# EAGLE design air-quality-sensor--module-rev-1p-skew-m (EAGLE 8.1.0)
COMPANY: ADAFRUIT INDUSTRIES; DRAWN: KTOWN; REV: B
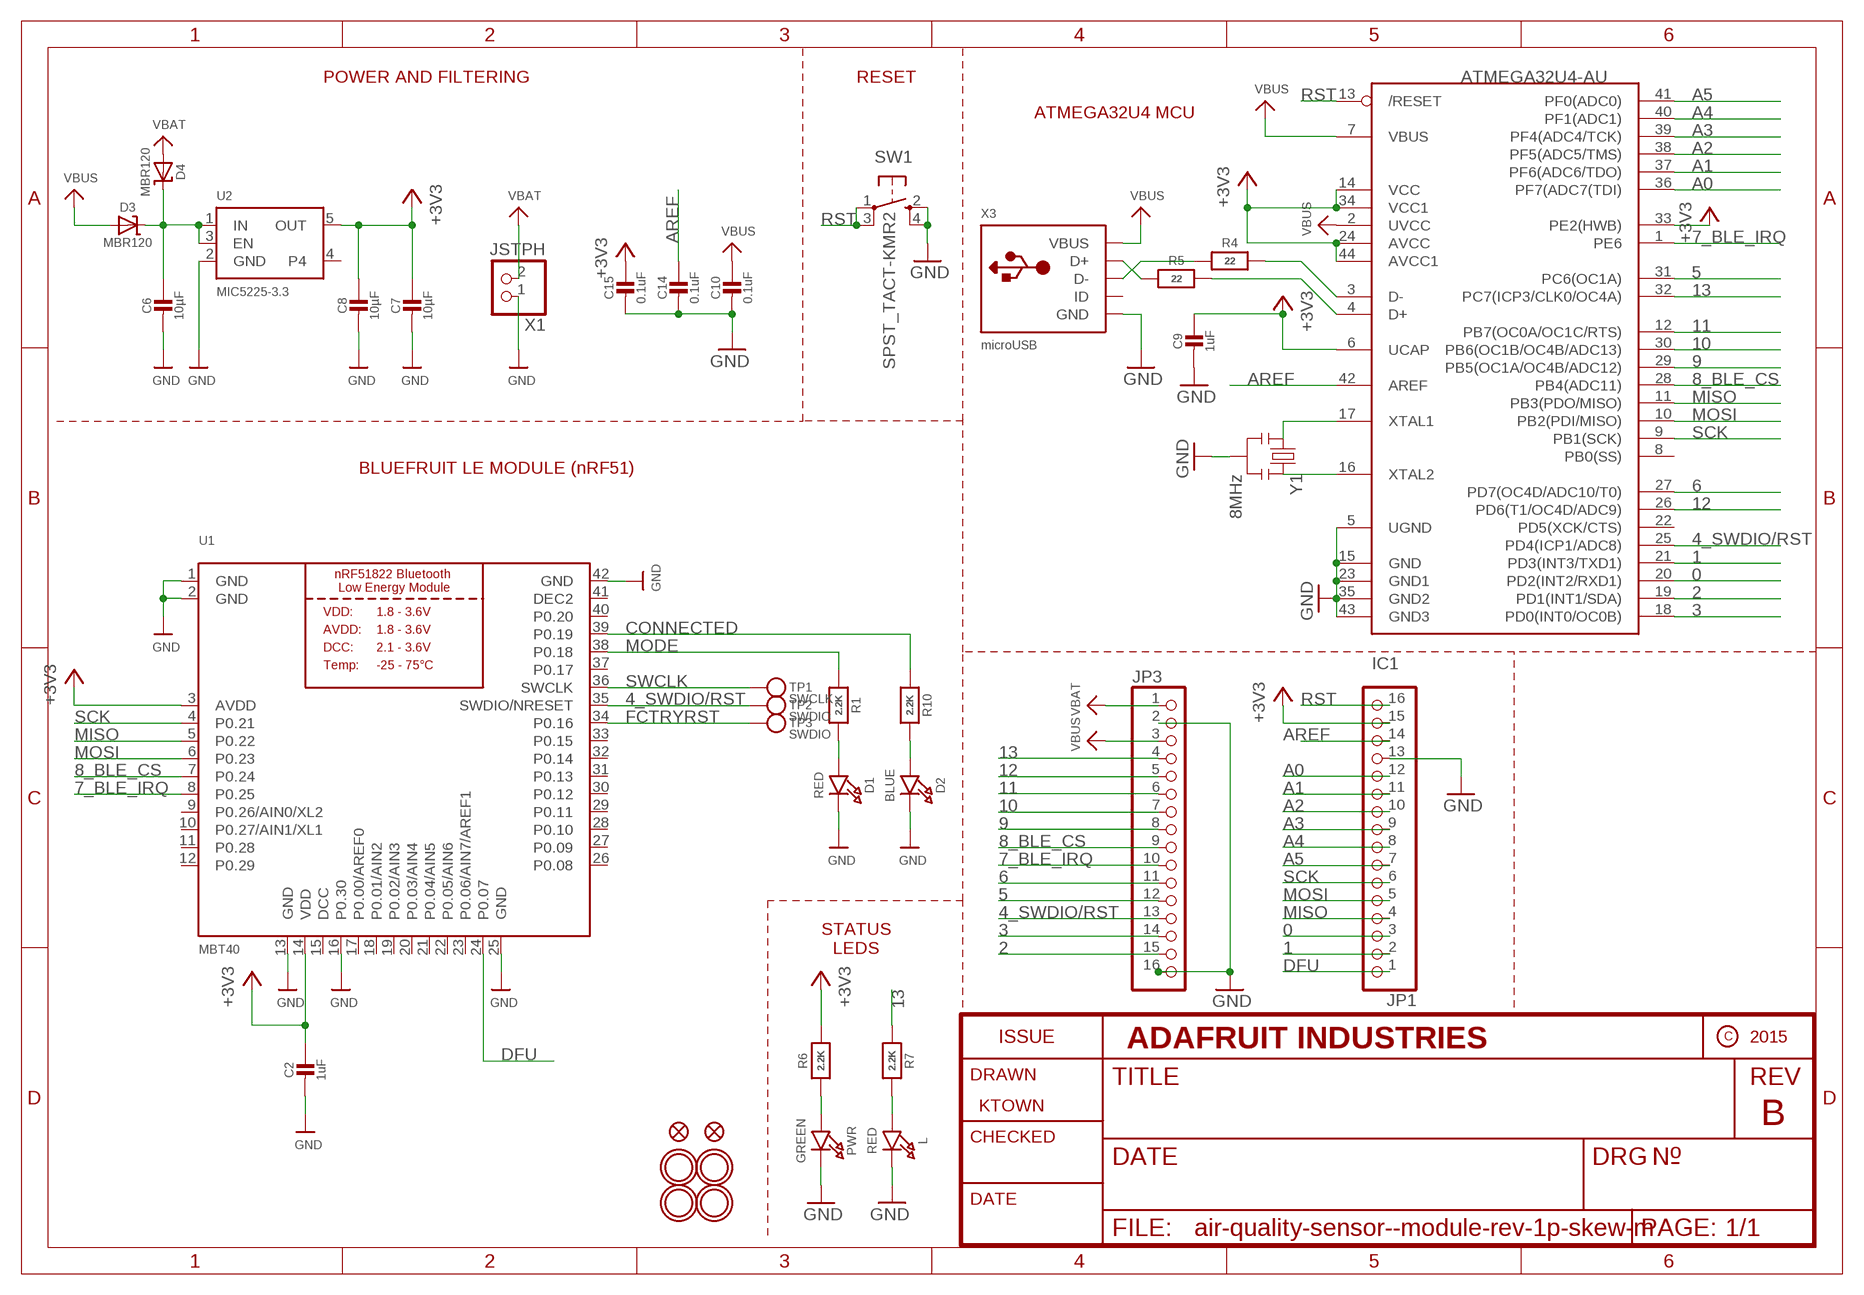
[diagram p0: schematic, sheet 1]

## Parts
C2  1uF  CAP_CERAMIC0805-NOOUTLINE  [0805-NO]
C6  10µF  CAP_CERAMIC_0805MP  [_0805MP]
C7  10µF  CAP_CERAMIC0805-NOOUTLINE  [0805-NO]
C8  10µF  CAP_CERAMIC0805-NOOUTLINE  [0805-NO]
C9  1uF  CAP_CERAMIC0805-NOOUTLINE  [0805-NO]
C10  0.1uF  CAP_CERAMIC0805_10MGAP  [0805_10MGAP]
C14  0.1uF  CAP_CERAMIC0805-NOOUTLINE  [0805-NO]
C15  0.1uF  CAP_CERAMIC0805-NOOUTLINE  [0805-NO]
D1  RED  LED0805_NOOUTLINE  [CHIPLED_0805_NOOUTLINE]
D2  BLUE  LED0805_NOOUTLINE  [CHIPLED_0805_NOOUTLINE]
D3  MBR120  DIODE-SCHOTTKYSOD-123  [SOD-123]
D4  MBR120  DIODE-SCHOTTKYSOD-123  [SOD-123]
IC1  ATMEGA32U4-AU  [TQFP44]
JP1  HEADER-1X16ROUND  [1X16_ROUND]
JP3  HEADER-1X16ROUND  [1X16_ROUND]
L  RED  LED0805_NOOUTLINE  [CHIPLED_0805_NOOUTLINE]
PWR  GREEN  LED0805_NOOUTLINE  [CHIPLED_0805_NOOUTLINE]
R1  2.2K  RESISTOR0805_NOOUTLINE  [0805-NO]
R4  22  RESISTOR0805_NOOUTLINE  [0805-NO]
R5  22  RESISTOR0805_NOOUTLINE  [0805-NO]
R6  2.2K  RESISTOR0805_NOOUTLINE  [0805-NO]
R7  2.2K  RESISTOR0805_NOOUTLINE  [0805-NO]
R10  2.2K  RESISTOR0805_NOOUTLINE  [0805-NO]
SW1  SPST_TACT-KMR2  [KMR2]
TP1  SWCLK  TESTPOINT1.5X2.0MM_NOCREAM  [PAD-1.5X2.0]
TP2  SWDIO  TESTPOINT1.5X2.0MM_NOCREAM  [PAD-1.5X2.0]
TP3  SWDIO  TESTPOINT1.5X2.0MM_NOCREAM  [PAD-1.5X2.0]
U1  MBT40  NRF51822_MODULE_MDBT40  [BLE_MODULE_RAYTAC_MDBT40]
U2  MIC5225-3.3  VREG_SOT23-5  [SOT23-5]
U$6  MOUNTINGHOLE2.5  [MOUNTINGHOLE_2.5_PLATED]
U$24  MOUNTINGHOLE2.5  [MOUNTINGHOLE_2.5_PLATED]
U$31  MOUNTINGHOLE2.5  [MOUNTINGHOLE_2.5_PLATED]
U$32  MOUNTINGHOLE2.5  [MOUNTINGHOLE_2.5_PLATED]
U$34  FIDUCIAL""  [FIDUCIAL_1MM]
U$35  FIDUCIAL""  [FIDUCIAL_1MM]
X1  JSTPH  CON_JST_PH_2PIN  [JSTPH2]
X3  microUSB  USBMICRO_20329  [4UCONN_20329]
Y1  8MHz  RESONATORSMD  [RESONATOR-SMD]

## Nets
0: IC1.20(PD2(INT2/RXD1)) JP1.3
1: IC1.21(PD3(INT3/TXD1)) JP1.2
2: IC1.19(PD1(INT1/SDA)) JP3.15
3: IC1.18(PD0(INT0/OC0B)) JP3.14
4_SWDIO/RST: IC1.25(PD4(ICP1/ADC8)) JP3.13 TP2.P$1 U1.35(SWDIO/NRESET)
5: IC1.31(PC6(OC1A)) JP3.12
6: IC1.27(PD7(OC4D/ADC10/T0)) JP3.11
7_BLE_IRQ: IC1.1(PE6) JP3.10 U1.8(P0.25)
8_BLE_CS: IC1.28(PB4(ADC11)) JP3.9 U1.7(P0.24)
9: IC1.29(PB5(OC1A/OC4B/ADC12)) JP3.8
10: IC1.30(PB6(OC1B/OC4B/ADC13)) JP3.7
11: IC1.12(PB7(OC0A/OC1C/RTS)) JP3.6
12: IC1.26(PD6(T1/OC4D/ADC9)) JP3.5
13: IC1.32(PC7(ICP3/CLK0/OC4A)) JP3.4 R7.1
+3V3: C2.1 C7.1 C8.1 C9.1 C15.1 IC1.6(UCAP) IC1.14(VCC) IC1.24(AVCC) IC1.33(PE2(HWB)) IC1.34(VCC1) IC1.44(AVCC1) JP1.15 R6.2 U1.3(AVDD) U1.14(VDD) U2.5(OUT)
A0: IC1.36(PF7(ADC7(TDI)) JP1.12
A1: IC1.37(PF6(ADC6/TDO)) JP1.11
A2: IC1.38(PF5(ADC5/TMS)) JP1.10
A3: IC1.39(PF4(ADC4/TCK)) JP1.9
A4: IC1.40(PF1(ADC1)) JP1.8
A5: IC1.41(PF0(ADC0)) JP1.7
AREF: C14.1 IC1.42(AREF) JP1.14
CONNECTED: R10.1 U1.39(P0.19)
DFU: JP1.1 U1.24(P0.07)
FCTRYRST: TP3.P$1 U1.34(P0.16)
GND: C2.2 C6.2 C7.2 C8.2 C9.2 C10.2 C14.2 C15.2 D1.C D2.C IC1.5(UGND) IC1.15(GND) IC1.23(GND1) IC1.35(GND2) IC1.43(GND3) JP1.13 JP3.2 JP3.16 L.C PWR.C SW1.2(S) SW1.4(S1) U1.1(GND) U1.2(GND) U1.13(GND) U1.16(P0.30) U1.25(GND) U1.42(GND) U2.2(GND) X1.1 X3.BASE@1(GND) X3.BASE@2(GND) X3.GND X3.SPRT@1(GND) X3.SPRT@2(GND) X3.SPRT@3(GND) X3.SPRT@4(GND) Y1.2
MISO: IC1.11(PB3(PDO/MISO)) JP1.4 U1.5(P0.22)
MODE: R1.1 U1.38(P0.18)
MOSI: IC1.10(PB2(PDI/MISO)) JP1.5 U1.6(P0.23)
N$2: L.A R7.2
N$5: D1.A R1.2
N$6: D2.A R10.2
N$9: IC1.3(D-) R4.2
N$10: IC1.4(D+) R5.2
N$11: IC1.16(XTAL2) Y1.3
N$12: IC1.17(XTAL1) Y1.1
N$13: PWR.A R6.1
N$15: R5.1 X3.D+
N$16: R4.1 X3.D-
N$17: C6.1 D3.C D4.C U2.1(IN) U2.3(EN)
RST: IC1.13(/RESET) JP1.16 SW1.1(P) SW1.3(P1)
SCK: IC1.9(PB1(SCK)) JP1.6 U1.4(P0.21)
SWCLK: TP1.P$1 U1.36(SWCLK)
VBAT: D4.A JP3.1 X1.2
VBUS: C10.1 D3.A IC1.2(UVCC) IC1.7(VBUS) JP3.3 X3.VBUS
Unconnected: IC1.8(PB0(SS)) IC1.22(PD5(XCK/CTS)) U1.9(P0.26/AIN0/XL2) U1.10(P0.27/AIN1/XL1) U1.11(P0.28) U1.12(P0.29) U1.17(P0.00/AREF0) U1.18(P0.01/AIN2) U1.19(P0.02/AIN3) U1.20(P0.03/AIN4) U1.21(P0.04/AIN5) U1.22(P0.05/AIN6) U1.23(P0.06/AIN7/AREF1) U1.26(P0.08) U1.27(P0.09) U1.28(P0.10) U1.29(P0.11) U1.30(P0.12) U1.31(P0.13) U1.32(P0.14) U1.33(P0.15) U1.37(P0.17) U1.40(P0.20) U2.4 X3.ID

## Notes on the sheet
- POWER AND FILTERING | RESET
- ATMEGA32U4 MCU
- BLUEFRUIT LE MODULE (nRF51)
- STATUS
  LEDS

## Power pins joined to a net without a drawn wire
DCC: U1.15(DCC)
DEC2: U1.41(DEC2)

## Library data of the parts
C2 C6-C10 C14 C15 = microbuilder:CAP_CERAMIC: Ceramic Capacitors For new designs, use the packages preceded by an '_' character since they are more reliable: The following footprints should be used on most boards: _0402 - Standard footprint for regular board layouts _0603 - Standard footprint for regular board layouts _0805 - Standard footprint for regular board layouts _1206 - Standard footprint for regular board layouts For extremely tight-pitch boards where space is at a premium, the following 'micro-pitch' footprints can be used (smaller pads, no silkscreen outline, etc.): _0402MP - Micro-pitch footprint for very dense/compact boards _0603MP - Micro-pitch footprint for very dense/compact boards _0805MP - Micro-pitch footprint for very dense/compact boards _1206MP - Micro-pitch footprint for very dense/compact boards
D1 D2 L PWR = microbuilder:LED: LED 0603 - 0603 Surface Mount Package 2mA: Green LED - Low Power (3.9mcd, 2ma, 1.7Vf) - Digikey: 475-2709-2-ND Orange LED - Low Power (9.8mcd, 2ma, 1.8Vf) - Digikey: 475-1194-2-ND Red LED - Low Power (5mcd, 2ma, 1.8Vf) - Digikey: 475-1195-2-ND Yellow LED - Low Power (7mcd, 2ma, 1.8Vf) - Digikey: 475-1196-2-ND 5mA: Blue LED - Low Power (17mcd, 5ma, 2.9Vf) - Digikey: LNJ937W8CRACT-ND 0805 - 0805 Surface Mount Package 2mA: Red LED (8.8mcd, 2mA, 1.8Vf, Clear) - Low Power [Digikey: 475-2510-1-ND] Green LED (5mcd, 2mA, 1.8Vf, Clear) - Low Power [Digikey: 475-2730-1-ND] Yellow LED (11.3mcd, 2mA, 1.8Vf, Clear) - Low Power [Digikey: 475-2555-1-ND] 20mA: Red LED (104mcd, 20mA, Diffused) - LS R976 [Digikey: 475-1278-6-ND] Red LED (12mcd, 20mA, 2.0Vf, Clear) - APT2012EC [Digikey: 754-1128-1-ND] Green LED (15mcd, 20mA, 2.2Vf, Clear) - APT2012GC [Digikey: 754-1131-1-ND] Orange LED (160mcd, 20mA, 2.1Vf, Clear) - APT2012SECK [Digikey: 754-1130-1-ND] 1206 - 1206 Surface Mount Package Green LED (26mcd, 20mA, Diffused) - LG N971 [Digikey: 475-1407-6-ND] Red LED (15mcd, 20mA, Diffused) - LH N974 [Digikey: 475-1416-6-ND] Cree - Cree High-Power Surface Mount LEDs XPEBWT-L1-0000-00D50 - White 111lm 350mA 2.9Vf 6200K 110° XTEAWT-00-0000-00000LEE3 - White 114lm 350mA 2.85Vf 5000K 115° Everlight - Everlight 45-21 Series Surface Mount LEDs 45-21/QK2C-B2832AC2CB2/2T - Warm White 2000mcd 20mA 3.25Vf 3050K 120° 45-21/LK2C-B38452C4CB2/2T - Nuetral White 2000mcd 20mA 3.25Vf 4150K 120° 45-21/LK2C-B50634C6CB2/2T - Cold White 2200mcd 20mA 3.25Vf 5650K 120° PLCC2 Reverse Mount LS T77K-J1L2-1-0-2-R18-Z - Red 11.25mcd 2mA 1.8Vf 630nm 120° LO T77K-L1M2-24-Z - Orange 19.6mcd 2mA 1.8Vf 606nm 120° LY T77K-K2M1-26-Z - Yellow 15.7mcd 2mA 1.8Vf 587nm 120°
D3 D4 = microbuilder:DIODE-SCHOTTKY
IC1 = adaprog:ATMEGA32U4
JP1 JP3 = microbuilder:HEADER-1X16: PIN HEADER
R1 R4-R7 R10 = microbuilder:RESISTOR: Resistors For new designs, use the packages preceded by an '_' character since they are more reliable: The following footprints should be used on most boards: _0402 - Standard footprint for regular board layouts _0603 - Standard footprint for regular board layouts _0805 - Standard footprint for regular board layouts _1206 - Standard footprint for regular board layouts For extremely tight-pitch boards where space is at a premium, the following 'micro-pitch' footprints can be used (smaller pads, no silkscreen outline, etc.): _0402MP - Micro-pitch footprint for very dense/compact boards _0603MP - Micro-pitch footprint for very dense/compact boards _0805MP - Micro-pitch footprint for very dense/compact boards _1206MP - Micro-pitch footprint for very dense/compact boards
SW1 = adafruit:SPST_TACT: SMT 6mm switch, EVQQ2 series http://www.ladyada.net/library/eagle
TP1-TP3 = microbuilder:TESTPOINT: Test Point Various test points for characterisation and PCB testing TESTPOINT_SMT - Compact Surface Mount Test Point [Digikey: 5016KTR-ND]
U1 = microbuilder:NRF51822_MODULE_MDBT40: nRF51822 Bluetooth Low Energy Module
U2 = microbuilder:VREG_SOT23-5: SOT23-5 Fixed Voltage Regulators Part Current Out V Out V In V Dropout θJA (°C/W) TJ (°C) Digikey Part No. ADP121 150mA 3.3V 3.4-5.5V 0.09V @ 150mA -- -- ADP121-AUJZ33R7CT-ND ADP121 150mA 3.0V 3.1-5.5V 0.09V @ 150mA -- -- ADP121-AUJZ30R7CT-ND ADP122 300mA 3.3V 3.4-5.5V 0.085V @ 300mA -- -- ADP122AUJZ-3.3-R7CT-ND ADP1712 300mA 3.3V 3.5-5.5V 0.17V @ 300mA -- -- ADP1712AUJZ-3.3-R7TR-ND AP7311 (Low Cost) 150mA 3.3V 3.5-6V 0.15V @ 150mA -- -- AP7311-33WG-7DICT-ND LD39015M18R 150mA 1.8V 1.9V-5.5V 0.08V @ 100mA -- -- 497-6977-1-ND LP2985A-33DBVR 150mA 3.3V 3.3-16V 0.28V @ 150mA 206 150 296-18479-1-ND MCP1824T-3302E/OT 300mA 3.3V 3.5V-6V 0.2V @ 300mA -- -- MCP1824T-3302E/OTCT-ND MIC5205-2.5YM5 TR 150mA 2.5V 2.7-16V 0.165V @ 150mA -- -- 576-1257-2-ND MIC5205-3.0YM5 TR 150mA 3.0V 3.2V-16V 0.165V @ 150mA -- -- 576-1258-2-ND MIC5205-3.3YM5 TR 150mA 3.3V 3.5V-16V 0.165V @ 150mA -- -- 576-1259-2-ND TPS780330220 150mA 3.3V+2.2V 3.6-5.5V 250mV Max -- -- 296-23332-1-ND TDA3663/N1,135 100mA 3.3V 3.5-45V 0.18V @ 50mA -- -- 568-5343-1-ND Max operating temp can be calculated using θJA, TJ (max junction temperature), and power in watts. Set the "Maximum Ambient Temperature" until it reaches TJ ("Max Junction Temperature"), which is the absolute limit for safe use of the regulator: Heat Sink Temperature Calculator <http://www.daycounter.com/Calculators/Heat-Sink-Temperature-Calculator.phtml> For example, With 12V source into a 3.3V LP2985 and a 30mA load, we are dissipating (12V-3.3V) * 0.03A = 0.261W. With a θJA of 206 °C/W, a TJ of 150°C, and 261mW we can safely use the chip without a heat sink up to 75°C (=147.1°C Junction Temperature).
U$6 U$24 U$31 U$32 = microbuilder:MOUNTINGHOLE: Mounting Hole For #2 screws (0.086"/2.18mm width, 0.094"/2.4mm hole) use 2.5mm; BOM: EXCLUDE
U$34 U$35 = microbuilder:FIDUCIAL: Fiducial Alignment Points Various fiducial points for machine vision alignment.; BOM: EXCLUDE
X1 = microbuilder:CON_JST_PH_2PIN: JST 2-Pin Right-Angle Connector PH-Series - 4UConnector: 17311 SH-Series - 4UConnector: 07278
X3 = microbuilder:USB: USB Connectors USBMINIB - Surface Mount Female Mini-B USB Connector 4UConnector: 06564
Y1 = SparkFun:RESONATOR: Resonator Small SMD resonator. This is the itty bitty 10/20MHz resonators with built in caps. CSTCE10M0G55 and CSTCE20M0V53. Footprint has been reviewed closely but hasn't been tested yet.

## Board
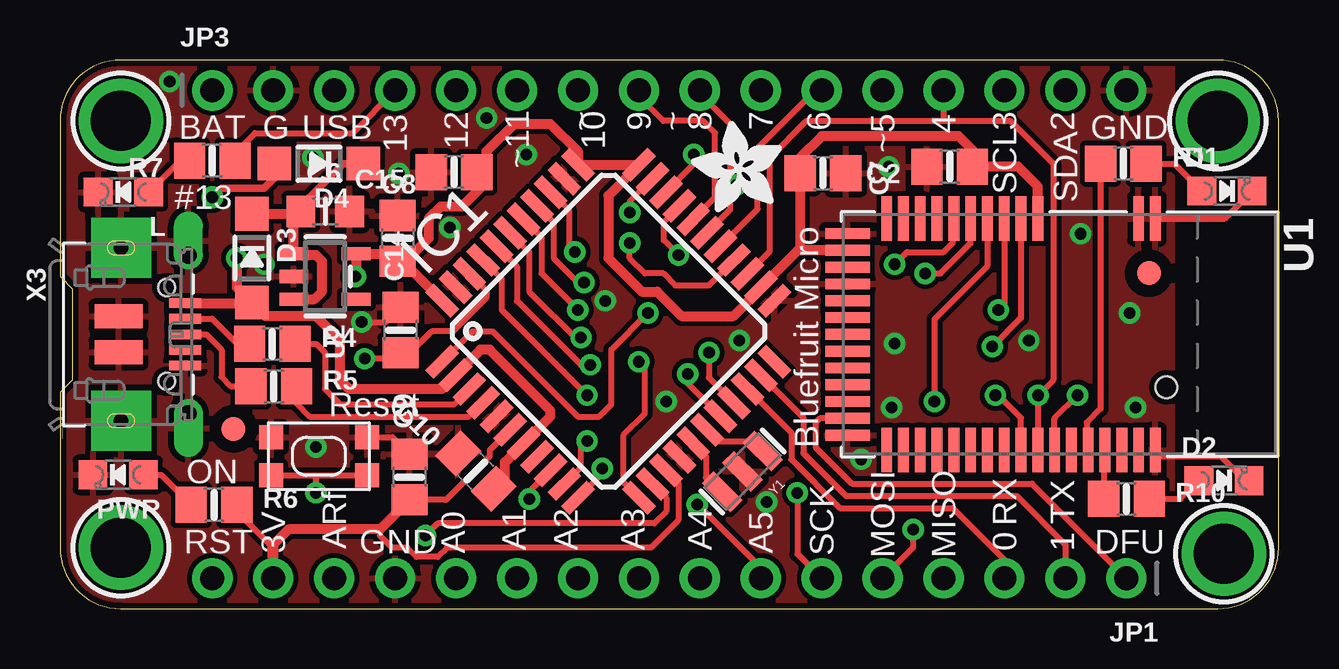
[diagram p1: board, top side]
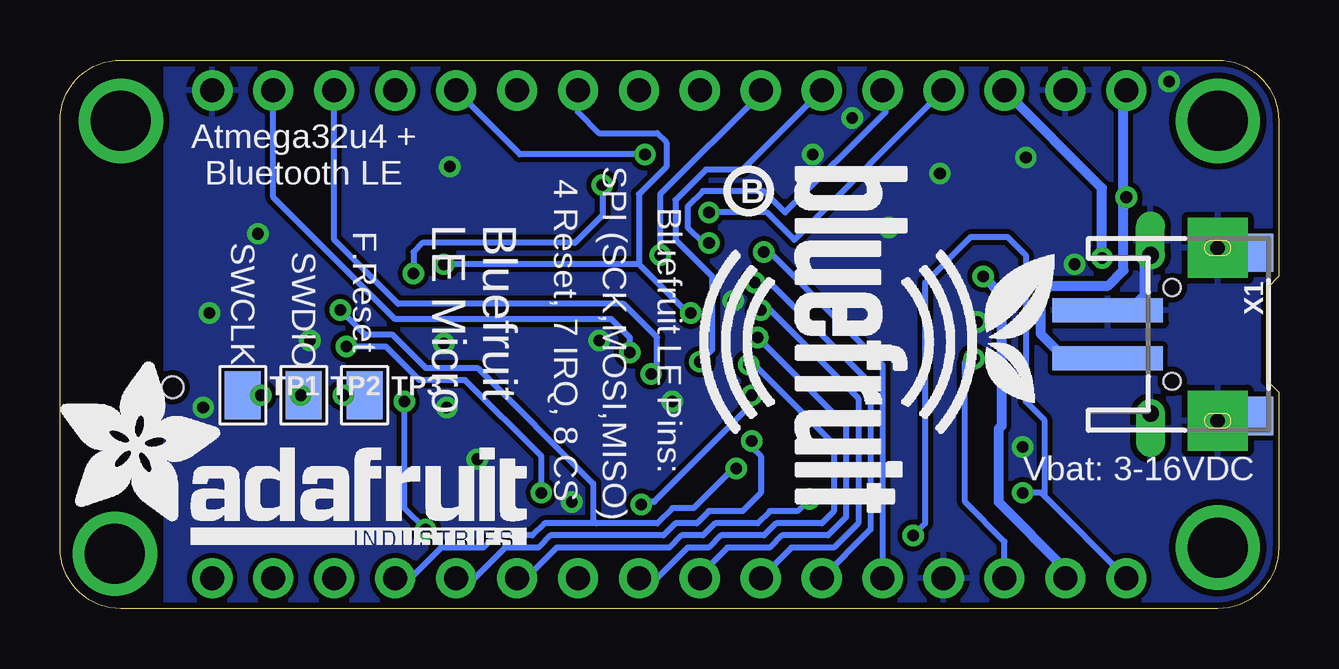
[diagram p2: board, bottom side, seen from below]

Size 50.8 x 22.86 mm. Coordinates in mm from the lower left corner, seen from the top.
Outline: 2.54,0 48.26,0 arc90 50.8,2.54 50.8,20.32 arc90 48.26,22.86 2.54,22.86 arc90 0,20.32 0,13.84 0.51,13.34 0.51,9.53 0,9.02 0,2.54 arc90 2.54,0
Copper layers (1*16): Top 0.035mm / dielectric 1.5mm / Bottom 0.035mm
Design rules "adafruit *": minimum track width 8mil, minimum drill 15.5mil, track to track 8mil, track to pad 8mil, pad to pad 8mil, via to via 8mil, smd to smd 8mil, copper to edge 10mil, drill to drill 8mil, minimum pad ring 10mil, minimum via ring 8mil, stop-mask expansion 2mil, vias tented up to drill 20mil, thermal gap 10mil

### Footprints (pad centres in the part's own frame; a part is rotated, then mirrored left to right if it is on the bottom)
0805-NO = smd 1.3 x 1.5: 1 -0.95,0; 2 0.95,0
_0805MP = smd 1.2 x 1.3: 1 -1.016,0; 2 1.016,0
0805_10MGAP = smd 1.2 x 1.5: 1 -1.05,0; 2 1.05,0
CHIPLED_0805_NOOUTLINE = smd 1.2 x 1.2: A 0,-1.05; C 0,1.05
SOD-123 = smd 1.4 x 1.4: A 1.85,0; C -1.85,0
TQFP44 = smd 1.5 x 0.5: 1 -5.8,4; 2 -5.8,3.2; 3 -5.8,2.4; 4 -5.8,1.6; 5 -5.8,0.8; 6 -5.8,0; 7 -5.8,-0.8; 8 -5.8,-1.6; 9 -5.8,-2.4; 10 -5.8,-3.2; 11 -5.8,-4; 23 5.8,-4; 24 5.8,-3.2; 25 5.8,-2.4; 26 5.8,-1.6; 27 5.8,-0.8; 28 5.8,0; 29 5.8,0.8; 30 5.8,1.6; 31 5.8,2.4; 32 5.8,3.2; 33 5.8,4 | smd 0.5 x 1.5: 12 -4,-5.8; 13 -3.2,-5.8; 14 -2.4,-5.8; 15 -1.6,-5.8; 16 -0.8,-5.8; 17 0,-5.8; 18 0.8,-5.8; 19 1.6,-5.8; 20 2.4,-5.8; 21 3.2,-5.8; 22 4,-5.8; 34 4,5.8; 35 3.2,5.8; 36 2.4,5.8; 37 1.6,5.8; 38 0.8,5.8; 39 0,5.8; 40 -0.8,5.8; 41 -1.6,5.8; 42 -2.4,5.8; 43 -3.2,5.8; 44 -4,5.8
1X16_ROUND = drill 1 pad 1.676: 1 -19.05,0; 2 -16.51,0; 3 -13.97,0; 4 -11.43,0; 5 -8.89,0; 6 -6.35,0; 7 -3.81,0; 8 -1.27,0; 9 1.27,0; 10 3.81,0; 11 6.35,0; 12 8.89,0; 13 11.43,0; 14 13.97,0; 15 16.51,0; 16 19.05,0
KMR2 = smd 1 x 1: 1 2,0.8; 2 2,-0.8; 3 -2,0.8; 4 -2,-0.8
PAD-1.5X2.0 = smd 1.5 x 2: P$1 0,0
BLE_MODULE_RAYTAC_MDBT40 = smd 1.85 x 0.45: 1 -4.825,4; 2 -4.825,3.3; 3 -4.825,-0.9; 4 -4.825,-1.6; 5 -4.825,-2.3; 6 -4.825,-3; 7 -4.825,-3.7; 8 -4.825,-4.4; 9 -4.825,-5.1; 10 -4.825,-5.8; 11 -4.825,-6.5; 12 -4.825,-7.2; 26 4.825,-7.2; 27 4.825,-6.5; 28 4.825,-5.8; 29 4.825,-5.1; 30 4.825,-4.4; 31 4.825,-3.7; 32 4.825,-3; 33 4.825,-2.3; 34 4.825,-1.6; 35 4.825,-0.9; 36 4.825,-0.2; 37 4.825,0.5; 38 4.825,1.2; 39 4.825,1.9; 40 4.825,2.6; 41 4.825,3.3; 42 4.825,4 | smd 0.45 x 1.85: 13 -4.2,-8.825; 14 -3.5,-8.825; 15 -2.8,-8.825; 16 -2.1,-8.825; 17 -1.4,-8.825; 18 -0.7,-8.825; 19 0,-8.825; 20 0.7,-8.825; 21 1.4,-8.825; 22 2.1,-8.825; 23 2.8,-8.825; 24 3.5,-8.825; 25 4.2,-8.825 | hole 0.9: 2.2,4.45
SOT23-5 = smd 0.55 x 1.2: 1 -0.95,-1.3; 2 0,-1.3; 3 0.95,-1.3; 4 0.95,1.3; 5 -0.95,1.3
MOUNTINGHOLE_2.5_PLATED = drill 2.5 pad 3.2: P$1 0,0
FIDUCIAL_1MM = smd 1 x 1: 1 0,0
JSTPH2 = smd 1 x 4.6: 1 -1,-3.7; 2 1,-3.7 | smd 1.6 x 3.4: NC1 -3.4,1.5; NC2 3.4,1.5
4UCONN_20329 = smd 1 x 2: BASE@1 -0.75,-2; BASE@2 0.75,-2 | smd 0.4 x 1.35: D+ 0,0.775; D- -0.65,0.775; GND 1.3,0.775; ID 0.65,0.775; VBUS -1.3,0.775 | drill 0.7 offset: SPRT@1 -3.3,0.9; SPRT@2 3.3,0.9 | drill 0.6 pad 2.5 square: SPRT@3 -3.6,-1.9; SPRT@4 3.6,-1.9 | hole 0.7: -1.95,0; 1.95,0
RESONATOR-SMD = smd 0.7 x 1.7: 1 -1.2,0; 2 0,0; 3 1.2,0

### Placement (x,y rotation side)
C2  37.08,18.41 180 top
C6  11.05,16.55 0 top
C7  31.8,18.14 0 top
C8  14.08,15.43 90 top
C9  14.57,5.48 90 top
C10  17.33,5.73 135 top
C14  14.2,11.61 90 top
C15  16.43,18.19 180 top
D1  48.64,17.4 270 top
D2  48.51,5.33 270 top
D3  8,14.61 270 top
D4  10.79,18.54 180 top
IC1  22.86,11.56 45 top
JP1  25.4,1.27 180 top
JP3  25.4,21.59 0 top
L  2.65,17.36 90 top
PWR  2.43,5.58 90 top
R1  44.32,18.54 0 top
R4  8.85,11.03 0 top
R5  8.91,9.26 0 top
R6  6.42,4.33 0 top
R7  6.35,18.67 180 top
R10  44.45,4.57 0 top
SW1  10.79,6.35 180 top
TP1  43.18,8.89 0 bottom
TP2  40.64,8.89 0 bottom
TP3  38.1,8.89 0 bottom
U1  41.66,11.43 270 top
U2  11.05,13.84 270 top
U$6  48.26,20.32 0 top
U$7  [ADAFRUIT_3.5MM]  30.1,16.51 90 top
U$9  [ADAFRUIT_TEXT_20MM]  50.93,2.67 0 bottom
U$15  [BLUEFRUITLOGO_150MM]  24.13,18.41 270 bottom
U$23  [PCBFEAT-REV-040]  22.1,17.4 0 bottom
U$24  48.51,2.29 0 top
U$31  2.54,20.32 270 top
U$32  2.54,2.54 270 top
U$34  7.24,7.49 270 top
U$35  45.39,13.98 270 top
X1  3.43,11.43 270 bottom
X3  4.45,11.43 270 top
Y1  28.45,5.71 225 top

### Tracks (layer width: path | path; a pad name or v marks a point on that pad's centre or on a via)
0
  Top 0.254: IC1.20 30.48,7.33 30.48,6.22 32.51,4.19 37.21,4.19 39.37,2.03 JP1.3
1
  Top 0.254: IC1.21 30.99,7.95 30.99,6.48 32.77,4.7 39.88,4.7 41.91,2.67 JP1.2
2  (via drill 0.48)
  Top 0.254: v27.05,10.67 27.05,9.63 IC1.19
  Bottom 0.254: v27.05,10.67 27.05,11.3 27.81,12.06 36.83,12.06 41.91,17.14 JP3.15
3  (via drill 0.48)
  Top 0.254: IC1.18 26.16,9.39 v26.16,9.78
  Bottom 0.254: v26.16,9.78 25.91,10.03 25.91,11.3 27.3,12.7 36.7,12.7 39.37,15.37 JP3.14
4_SWDIO/RST  (via drill 0.48)
  Top 0.254: 36.83,20.32 31.11,20.32 29.59,18.8 29.59,14.89 IC1.25 | JP3.13 36.83,20.32 | 36.83,20.32 39.62,20.32 41.4,18.54 41.4,9.53 v40.77,8.89 40.77,6.62 U1.35
  Bottom 0.254: v40.77,8.89 40.77,9.02 TP2.P$1
5  (via drill 0.48)
  Top 0.254: IC1.31 26.42,18.51 v26.42,18.92
  Bottom 0.254: v26.42,18.92 31.62,18.92 JP3.12
6
  Top 0.254: IC1.27 29.08,16.65 29.08,19.18 31.5,21.59 JP3.11
7_BLE_IRQ  (via drill 0.48)
  Top 0.254: IC1.1 17.2,11.56 18.03,11.56 21.59,8 22.48,8 22.99,8.51 22.99,10.79 v24.51,12.32 | v34.8,14.35 35.31,14.86 36.83,14.86 37.21,15.24 37.21,16.21 U1.8
  Bottom 0.254: JP3.10 29.21,20.7 28.32,19.81 25.91,19.81 25.53,19.43 25.53,18.41 26.67,17.27 26.67,14.35 | 26.67,14.35 v34.8,14.35 | 26.67,14.35 24.64,12.32 v24.51,12.32
8_BLE_CS  (via drill 0.48)
  Top 0.254: IC1.28 27.94,16.64 27.94,17.65 | 27.94,17.65 27.94,20.19 26.67,21.46 JP3.9 | 27.94,17.65 v28.19,17.65 | v36.07,13.97 36.7,13.97 37.96,15.22 U1.7
  Bottom 0.254: v28.19,17.65 28.19,16.38 29.34,15.24 35.69,15.24 36.07,14.86 v36.07,13.97
9
  Top 0.254: IC1.29 27.3,17.13 27.3,19.81 26.8,20.32 25.15,20.32 24.13,21.34 JP3.8
10  (via drill 0.48)
  Top 0.254: IC1.30 25.17,16.13 25.17,15.34 v25.78,14.73
  Bottom 0.254: v25.78,14.73 25.78,17.27 21.59,21.46 JP3.7
11  (via drill 0.48)
  Top 0.254: IC1.12 23.5,5.26 23.5,7.24 24.38,8.13 24.38,10.03 v24.13,10.29
  Bottom 0.254: JP3.6 22.35,18.29 23.88,18.29 25.15,17.02 25.15,15.37 23.62,13.84 23.62,10.79 v24.13,10.29
12  (via drill 0.48)
  Top 0.254: v23.75,15.24 23.75,14.61 24.38,13.97 25.15,13.97 25.65,13.46 27.03,13.46 IC1.26
  Bottom 0.254: JP3.5 16.38,21.46 16.38,20.7 20.57,16.51 21.46,17.4 24,17.4 24.64,16.76 24.64,15.88 24,15.24 v23.75,15.24
13  (via drill 0.48)
  Top 0.254: IC1.32 23.75,16.97 v23.75,16.51 | R7.1 7.3,18.98 8.13,19.81 12.19,19.81 JP3.4
  Bottom 0.254: JP3.4 20.19,15.37 21.34,16.51 v23.75,16.51
+3V3  (via drill 0.48)
  Top 0.254: R6.2 7.37,4.06 8.76,2.67 8.76,1.4 JP1.15 | IC1.6 17.91,6.6 17.91,6.35 16.09,4.53 C9.1 | IC1.14 25.78,5.24 25.78,3.68 24.64,2.54 16.13,2.54 15.75,2.16 14.86,2.16 14.48,2.54 13.84,2.54 13.34,3.04 13.34,3.3
  Top 0.406: C8.1 13.77,14.79 U2.5 12.35,13.87 v12.32,13.84 | 14.54,14.6 15.37,15.43 15.37,16.26 15.88,16.76 16.76,16.76 17.65,17.65 17.65,17.91 C15.1 17.78,18.59 17.78,19.05 18.92,20.19 20.45,20.19 21.59,19.05 IC1.34 IC1.33 22.86,17.21 22.86,14.61 24.26,13.21 24.89,13.21 25.91,12.19 28.07,12.19 29.1,13.22 29.1,13.27 IC1.24 30.84,15.01 | C9.1 13.34,3.3 9.53,3.3 8.89,2.67 JP1.15 | U1.3 40.76,17.6 39.94,18.41 C2.1 38.03,19.12 37.47,19.68 31.75,19.68 30.85,18.79 C7.1 30.85,15.02 30.84,15.01 | U1.14 30.92,14.93 30.84,15.01 | 14.66,14.6 14.54,14.6 | IC1.44 14.28,14.48 C8.1 | 14.54,14.6 14.41,14.48 C8.1
  Bottom 0.406: v12.32,13.84 11.56,13.08 11.56,7.62 11.68,7.49 11.68,4.45 8.89,1.65 JP1.15
A0  (via drill 0.48)
  Top 0.254: IC1.36 21.21,16.6 21.21,15.11 v21.46,14.86
  Bottom 0.254: JP1.12 16.51,10.16 21.21,14.86 v21.46,14.86
A1  (via drill 0.48)
  Top 0.254: IC1.37 20.57,16.11 20.57,14.61 21.59,13.59 v21.84,13.59
  Bottom 0.254: 21.34,13.59 v21.84,13.59 21.21,13.59 17.02,9.4 17.02,3.3 JP1.11
A2  (via drill 0.48)
  Top 0.254: IC1.38 20.07,15.48 20.07,13.97 v21.59,12.45
  Bottom 0.254: JP1.10 20.32,2.54 18.54,2.54 17.53,3.56 17.53,8.76 21.21,12.45 v21.59,12.45
A3  (via drill 0.48)
  Top 0.254: IC1.39 19.56,14.86 19.56,13.21 21.59,11.18 v21.72,11.3
  Bottom 0.254: v21.72,11.3 18.03,7.62 18.03,3.81 18.8,3.05 20.7,3.05 21.21,2.54 22.99,2.54 24.13,1.4 JP1.9
A4  (via drill 0.48)
  Top 0.254: IC1.40 19.05,14.24 19.05,12.83 21.72,10.16 v22.1,10.16
  Bottom 0.254: v22.1,10.16 21.84,10.16 18.54,6.86 18.54,4.06 19.05,3.56 20.95,3.56 21.46,3.05 23.24,3.05 23.75,2.54 24.64,2.54 25.91,1.27 JP1.8
A5  (via drill 0.48)
  Top 0.254: IC1.41 18.41,13.74 18.41,12.45 v21.97,8.89 | JP1.7 29.21,1.7 v26.57,4.34
  Bottom 0.254: v21.97,8.89 21.97,8.51 26.04,4.45 26.47,4.45 v26.57,4.34
AREF  (via drill 0.48)
  Top 0.254: IC1.42 17.78,13.24 17.78,12.95 16.38,11.56 15.49,11.56 14.6,10.66 C14.1 13.95,10.41 v12.7,10.41
  Bottom 0.254: JP1.14 11.43,2.79 13.08,4.45 13.08,10.29 12.95,10.41 v12.7,10.41
CONNECTED
  Top 0.254: U1.39 43.5,6.55 R10.1
DFU
  Top 0.254: U1.24 31.68,7.93 31.5,7.75 31.5,6.73 33.02,5.21 40.51,5.21 JP1.1
FCTRYRST  (via drill 0.48)
  Top 0.254: U1.34 40.06,7.95 39.12,8.89 v38.99,8.89
  Bottom 0.254: v38.99,8.89 TP3.P$1
GND  (via drill 0.48)
  Top 0.254: SW1.4 13.86,7.15 C9.2 | v12.57,11.94 13.58,11.94 C14.2 | U1.42 45.91,6.35 48.39,6.35 49.4,5.33 D2.C | U1.1 48.55,16.25 D1.C
  Bottom 0.406: X1.1 6.24,12.43 5.59,13.08 5.59,14.49 X3.SPRT@1
  other vias: 19.43,18.92 16.26,15.88 22.73,12.83 10.67,6.73 14.12,18.14 17.78,20.45 44.83,8.38 34.54,18.41 25.27,8.64 29.46,4.45 33.4,6.22 34.67,8.38 44.58,12.32 28.32,11.18 34.8,11.05 42.55,15.62 10.54,18.8 40.39,11.18 4.57,21.97 8.51,14.35
  pour Top: -0.25,22.86 0,0 46.35,0 46.35,22.86
  pour Bottom: 0,0 46.35,0 46.35,22.86 -0.13,22.86
MISO  (via drill 0.48)
  Top 0.254: U1.5 39.36,12.69 v39.12,12.45 | IC1.11 22.61,5.65 v22.61,5.84
  Bottom 0.254: 28.45,3.56 25.91,3.56 25.27,4.19 24.38,4.19 22.73,5.84 v22.61,5.84 | v39.12,12.45 38.1,11.43 36.96,11.43 35.56,10.03 33.4,10.03 28.57,5.21 28.57,3.68 28.45,3.56 | 28.45,3.56 30.61,3.56 31.11,3.05 32.64,3.05 33.15,2.54 34.92,2.54 36.2,1.27 JP1.4
MODE
  Top 0.254: R1.1 43.37,8.32 42.8,7.75 42.8,6.66 U1.38
MOSI  (via drill 0.48)
  Top 0.254: IC1.10 21.72,5.89 21.72,6.73 v21.97,6.99 | U1.6 38.66,14.27 36.45,12.06 v36.45,8.64 | v35.56,3.3 35.56,2.54 JP1.5
  Bottom 0.254: v21.97,6.99 21.97,6.73 21.59,6.35 21.59,4.83 22.35,4.06 23.75,4.06 24.26,3.56 25.15,3.56 25.65,3.05 30.35,3.05 30.86,2.54 32.26,2.54 33.53,1.27 JP1.5 | v36.45,8.64 36.45,4.19 v35.56,3.3
N$2
  Top 0.254: L.A 5,18.67 R7.2
N$5
  Top 0.254: R1.2 46.45,18.54 D1.A
N$6
  Top 0.254: R10.2 46.7,4.57 D2.A
N$9
  Top 0.254: R4.2 10.69,11.03 11.05,10.67 11.05,9.14 11.68,8.51 16.42,8.51 IC1.3
N$10
  Top 0.254: R5.2 9.86,8.55 10.41,8 17.04,8 IC1.4
N$11
  Top 0.254: IC1.16 26.92,6.36 26.92,5.46 27.22,5.17 27.3,5.17 Y1.3
N$12
  Top 0.254: IC1.17 27.43,6.99 28.83,6.99 29,6.82 29.04,6.82 Y1.1
N$13
  Top 0.254: PWR.A 4.22,5.58 R6.1
N$15
  Top 0.254: X3.D+ 6.1,11.43 6.73,10.79 6.73,9.65 7.11,9.27 7.95,9.27 R5.1
N$16
  Top 0.254: X3.D- 6.33,12.08 7.38,11.03 R4.1
N$17
  Top 0.305: C6.1 10.04,16.77 11.81,18.54 D4.C
  Top 0.406: D3.C 9.94,16.45 C6.1 9.75,16.26 U2.1 9.81,14.73 10.67,14.73 10.92,14.48 10.92,13.21 10.61,12.89 U2.3
RST  (via drill 0.48)
  Top 0.254: v10.67,4.83 10.67,5.55 | 10.67,5.55 SW1.3 | SW1.1 10.67,5.55 | IC1.13 25.27,4.62 25.27,4.06 24.77,3.56 15.75,3.56 v15.24,3.05
  Bottom 0.254: JP1.16 9.78,4.7 | 9.78,4.7 9.91,4.83 v10.67,4.83 | v15.24,3.05 14.73,3.56 14.73,13.59 12.83,15.49 11.3,15.49 10.54,14.73 10.54,8.64 9.78,7.87 9.78,4.7
SCK  (via drill 0.48)
  Top 0.254: IC1.9 19.56,4.86 v19.56,4.57 | U1.4 40.06,12.12 v38.86,10.92 | v30.73,4.83 30.73,2.29 JP1.6
  Bottom 0.254: JP1.6 31.37,1.27 30.1,2.54 25.4,2.54 24.89,3.05 24,3.05 23.5,3.56 21.72,3.56 21.21,4.06 20.07,4.06 v19.56,4.57 | v30.73,4.83 30.73,6.35 33.91,9.53 35.81,9.53 37.21,10.92 v38.86,10.92
SWCLK  (via drill 0.48)
  Top 0.254: U1.36 41.46,7.93 v42.42,8.89
  Bottom 0.254: v42.42,8.89 TP1.P$1
VBAT  (via drill 0.5)
  Top 0.305: D4.A 8.95,17.96 8.51,17.53 6.73,17.53 v6.35,17.14
  Top 0.406: 6.73,21.59 JP3.1
  Bottom 0.305: v6.35,17.14 6.48,17.14
  Bottom 0.406: X1.2 8.91,10.43 9.91,11.43 9.91,13.08 9.53,13.46 7.11,13.46 6.48,14.1 6.48,17.14 6.48,21.46 JP3.1
VBUS  (via drill 0.48)
  Top 0.406: D3.A 8.56,12.19 10.67,12.19 11.68,11.18 11.68,9.53 12.06,9.14 15.92,9.14 IC1.2 16.5,9.77 17.53,10.79 17.91,10.79 20.45,8.26 20.45,8.01 IC1.7 18.54,6.11 18.54,5.46 C10.1 | X3.VBUS 8,12.73 D3.A | v7.37,14.61 7.37,13.39 D3.A
  Bottom 0.406: v7.37,14.61 7.37,17.53 JP3.3

### Text on the board
tPlace: BAT | G | USB | 13 | 12 | ~11 | ~ | 10 | 9 | ~ | 8 | 7 | 6 | ~5 | 4 | 3 | 2 | GND | SCL | SDA | #13 | Bluefruit Micro | Reset | ON | ARf | SCK | MOSI | MISO | RX | TX | RST | 3V | GND | A0 | A1 | A2 | A3 | A4 | A5 | 0 | 1 | DFU
bPlace: Atmega32u4 + / Bluetooth LE | F.Reset | SWCLK | Bluefruit / LE Micro | SWDIO | Bluefruit LE Pins: | SPI (SCK,MOSI,MISO) | 4 Reset, 7 IRQ, 8 CS | Vbat: 3-16VDC